# Altium schematic sheet DualBuck.SchDoc
size Legal
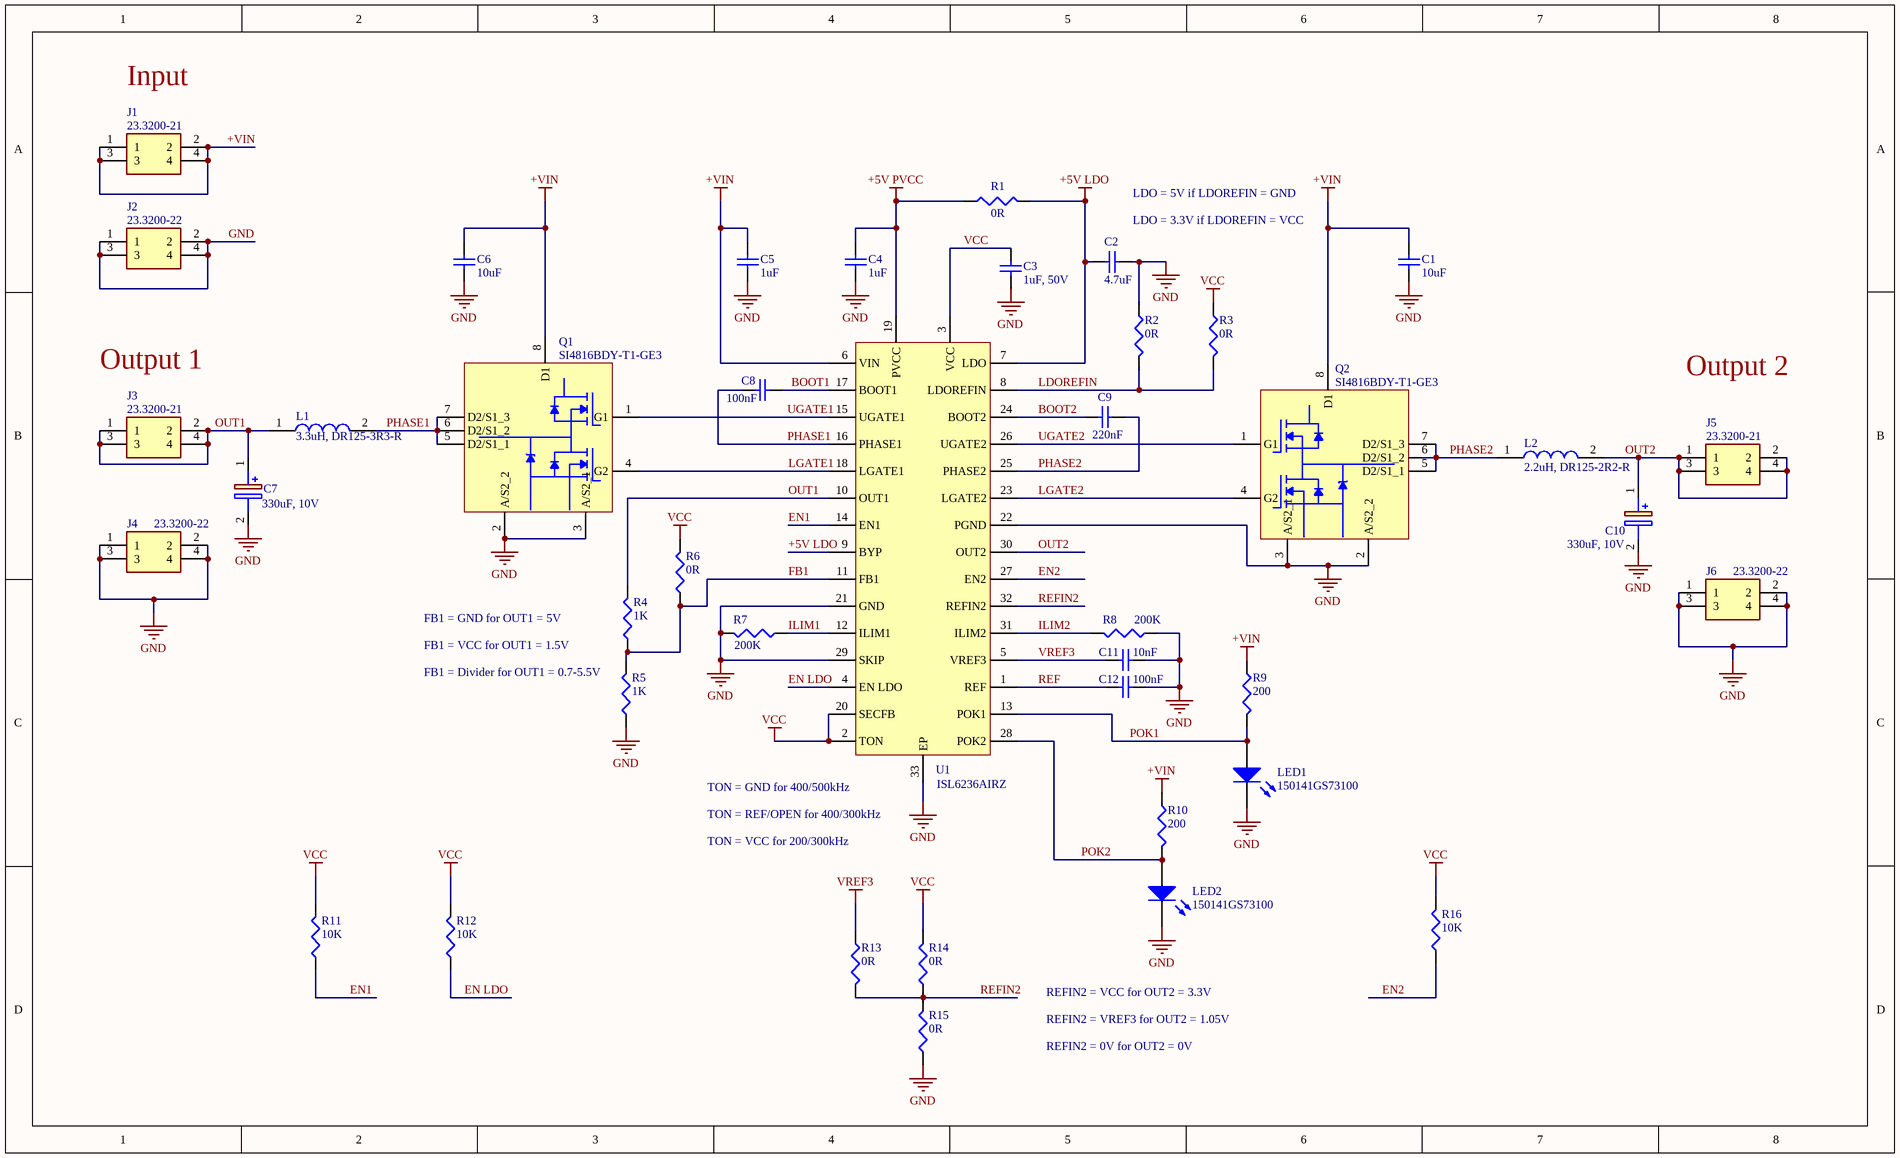
[diagram p0: DualBuck.SchDoc]

## Parts
C1  value 10uF  [C1210]
C2  value 4.7uF  [C1206]
C3  value 1uF, 50V  [C0805]
C4  value 1uF  [C0805]
C5  value 1uF  [C0805]
C6  value 10uF  [C1210]
C7  330uF, 10V  [CAPPM7343X430N]
C8  value 100nF  [C0805]
C9  value 220nF  [C0805]
C10  330uF, 10V  [CAPPM7343X430N]
C11  value 10nF  [C0805]
C12  value 100nF  [C0805]
J1  23.3200-21  [23320021]
J2  23.3200-22  [23320022]
J3  23.3200-21  [23320021]
J4  23.3200-22  [23320022]
J5  23.3200-21  [23320021]
J6  23.3200-22  [23320022]
L1  3.3uH, DR125-3R3-R  [INDPM125125X600N]
L2  2.2uH, DR125-2R2-R  [INDPM125125X600N]
LED1  150141GS73100  [3528]
LED2  150141GS73100  [3528]
Q1  SI4816BDY-T1-GE3  [SOT127P600X175-8N]
Q2  SI4816BDY-T1-GE3  [SOT127P600X175-8N]
R1  value 0R  [R0805]  (hidden comment: Res3)
R2  value 0R  [R0805]  (hidden comment: Res3)
R3  value 0R  [R0805]  (hidden comment: Res3)
R4  value 1K  [R0805]  (hidden comment: Res3)
R5  value 1K  [R0805]  (hidden comment: Res3)
R6  value 0R  [R0805]  (hidden comment: Res3)
R7  value 200K  [R0805]  (hidden comment: Res3)
R8  value 200K  [R0805]  (hidden comment: Res3)
R9  value 200  [R0805]  (hidden comment: Res3)
R10  value 200  [R0805]  (hidden comment: Res3)
R11  value 10K  [R0805]
R12  value 10K  [R0805]  (hidden comment: Res3)
R13  value 0R  [R0805]  (hidden comment: Res3)
R14  value 0R  [R0805]  (hidden comment: Res3)
R15  value 0R  [R0805]  (hidden comment: Res3)
R16  value 10K  [R0805]  (hidden comment: Res3)
U1  ISL6236AIRZ  [QFN50P500X500X100-33N]

## Nets
+5V LDO: C2.2 R1.2 U1.7(LDO) U1.9(BYP)
+5V PVCC: C4.2 R1.1 U1.19(PVCC)
+VIN: C1.2 C5.2 C6.2 J1.1 J1.2 J1.3 J1.4 Q1.8(D1) Q2.8(D1) R9.1 R10.1 U1.6(VIN)
GND: C1.1 C2.1 C3.1 C4.1 C5.1 C6.1 C7.2(-) C10.2(-) C11.1 C12.1 J2.1 J2.2 J2.3 J2.4 J4.1 J4.2 J4.3 J4.4 J6.1 J6.2 J6.3 J6.4 LED1.1(K) LED2.1(K) Q1.2(A/S2_2) Q1.3(A/S2_1) Q2.2(A/S2_2) Q2.3(A/S2_1) R2.1 R5.1 R7.2 R8.1 R15.2 U1.21(GND) U1.22(PGND) U1.29(SKIP) U1.33(EP)
VCC: C3.2 R3.1 R6.2 R11.2 R12.2 R14.1 R16.2 U1.2(TON) U1.3(VCC) U1.20(SECFB)
VREF3: C11.2 R13.1 U1.5(VREF3)
BOOT1: C8.1 U1.17(BOOT1)
BOOT2: C9.2 U1.24(BOOT2)
EN1: R11.1 U1.14(EN1)
EN2: R16.1 U1.27(EN2)
EN LDO: R12.1 U1.4(EN_LDO)
FB1: R4.1 R5.2 R6.1 U1.11(FB1)
ILIM1: R7.1 U1.12(ILIM1)
ILIM2: R8.2 U1.31(ILIM2)
LDOREFIN: R2.2 R3.2 U1.8(LDOREFIN)
LGATE1: Q1.4(G2) U1.18(LGATE1)
LGATE2: Q2.4(G2) U1.23(LGATE2)
OUT1: C7.1(+) J3.1 J3.2 J3.3 J3.4 L1.1 R4.2 U1.10(OUT1)
OUT2: C10.1(+) J5.1 J5.2 J5.3 J5.4 L2.2 U1.30(OUT2)
PHASE1: C8.2 L1.2 Q1.5(D2/S1_1) Q1.6(D2/S1_2) Q1.7(D2/S1_3) U1.16(PHASE1)
PHASE2: C9.1 L2.1 Q2.5(D2/S1_1) Q2.6(D2/S1_2) Q2.7(D2/S1_3) U1.25(PHASE2)
POK1: LED1.2(A) R9.2 U1.13(POK1)
POK2: LED2.2(A) R10.2 U1.28(POK2)
REF: C12.2 U1.1(REF)
REFIN2: R13.2 R14.2 R15.1 U1.32(REFIN2)
UGATE1: Q1.1(G1) U1.15(UGATE1)
UGATE2: Q2.1(G1) U1.26(UGATE2)

## Notes on the sheet
- Input
- LDO = 5V if LDOREFIN = GND
- (near C2) LDO = 3.3V if LDOREFIN = VCC
- Output 1
- Output 2
- FB1 = GND for OUT1 = 5V
- FB1 = VCC for OUT1 = 1.5V
- (near R5) FB1 = Divider for OUT1 = 0.7-5.5V
- (near U1) TON = GND for 400/500kHz
- TON = REF/OPEN for 400/300kHz
- TON = VCC for 200/300kHz
- REFIN2 = VCC for OUT2 = 3.3V
- REFIN2 = VREF3 for OUT2 = 1.05V
- REFIN2 = 0V for OUT2 = 0V
- Title
- Size:
- Date:
- B
- Number:
- Time:
- Revision:
- Sheet
- of
- File:

## Library data of the parts
C1-C6 C8 C9 C11 C12 = Cap: Capacitor; Published: 8-Jun-2000; LatestRevisionDate: 17-Jul-2002; LatestRevisionNote: Re-released for DXP Platform.; PackageReference: RAD-0.3; Publisher: Altium Limited; PackageDescription: Radial Cap, Thru-Hole; 2 Leads; 0.3 in Pin Spacing
C7 C10 = T530X337M010ATE004: Capacitor Polarised; Manufacturer_Name: Kemet; Datasheet Link: http://capacitoredge.kemet.com/capedge2/DataSheet?pn=T530X337M010ATE004; Height: 4.3mm; Manufacturer_Part_Number: T530X337M010ATE004; Mouser Part Number: 80-T530X337M010ATE4; Mouser Price/Stock: https://www.mouser.com/Search/Refine.aspx?Keyword=80-T530X337M010ATE4; RS Part Number: 6925817; RS Price/Stock: https://uk.rs-online.com/web/p/products/6925817
J1 J3 J5 = 23.3200-21: Connector; Manufacturer_Name: Multi Contact; Datasheet Link: https://docs-emea.rs-online.com/webdocs/025b/0900766b8025b994.pdf; Height: 11mm; Manufacturer_Part_Number: 23.3200-21; RS Part Number: 4225051; RS Price/Stock: http://uk.rs-online.com/web/p/products/4225051
J2 J4 J6 = 23.3200-22: Connector; Manufacturer_Name: Multi Contact; Datasheet Link: http://www.farnell.com/datasheets/2827925.pdf?_ga=2.233889822.1621494036.1565215269-167411096.1502103357; Height: 14.9mm; Manufacturer_Part_Number: 23.3200-22; RS Part Number: 4225067; RS Price/Stock: http://uk.rs-online.com/web/p/products/4225067
L1 = DR125-3R3-R: Inductor; Manufacturer_Name: Cooper Bussmann; Datasheet Link: http://www.cooperindustries.com/content/dam/public/bussmann/Electronics/Resources/product-datasheets/Bus_Elx_DS_4315_DR_Series.pdf; Height: 6mm; Manufacturer_Part_Number: DR125-3R3-R; RS Part Number: 7700974; RS Price/Stock: https://uk.rs-online.com/web/p/products/7700974
L2 = DR125-2R2-R: Inductor; Manufacturer_Name: Cooper Bussmann; Datasheet Link: http://www1.cooperbussmann.com/pdf/4a32919a-7470-4ae0-be45-b59e3a1351ef.pdf; Height: 6mm; Manufacturer_Part_Number: DR125-2R2-R; RS Part Number: 7700968; RS Price/Stock: https://uk.rs-online.com/web/p/products/7700968
LED1 LED2 = 150141GS73100: SMD mono-color Top LED, WL-SMTW, Green; PackageReference: 3528; Color: Green; PartNumber: 150141GS73100; ComponentLink1Description: Manufacturer URL; ComponentLink1URL: http://www.we-online.com; ComponentLink2Description: Datasheet; ComponentLink2URL: http://katalog.we-online.com/led/datasheet/150141GS73100.pdf
Q1 Q2 = SI4816BDY-T1-GE3: Integrated Circuit
R1-R16 = Res3: Resistor; Published: 8-Jun-2000; LatestRevisionDate: 29-May-2009; LatestRevisionNote: IPC-7351 Footprint Added.; PackageReference: J1-0603; Publisher: Altium Limited; PackageDescription: Chip Resistor
U1 = ISL6236AIRZ: Integrated Circuit